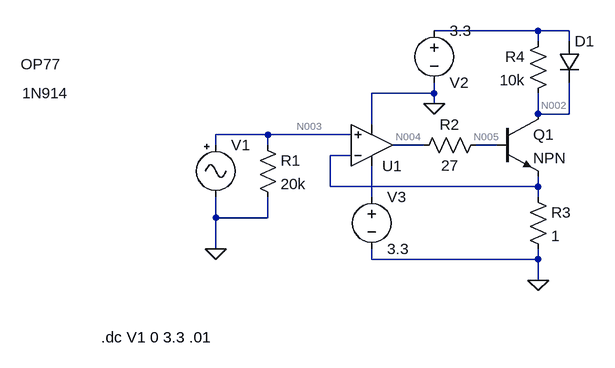
[diagram p0: schematic DiffoP.asc]
DiffoP.asc, the LTspice schematic file:
Version 4
SHEET 1 1828 680
WIRE 448 -32 288 -32
WIRE 496 -32 448 -32
WIRE 448 -16 448 -32
WIRE 496 -16 496 -32
WIRE 288 64 288 48
WIRE 288 64 192 64
WIRE 288 80 288 64
WIRE 448 96 448 64
WIRE 496 96 496 48
WIRE 496 96 448 96
WIRE 192 112 192 64
WIRE 32 128 -48 128
WIRE 160 128 32 128
WIRE -48 144 -48 128
WIRE 32 144 32 128
WIRE 272 144 224 144
WIRE 384 144 352 144
WIRE 160 160 128 160
WIRE 128 208 128 160
WIRE 448 208 448 192
WIRE 448 208 128 208
WIRE 192 224 192 176
WIRE 448 224 448 208
WIRE -48 256 -48 224
WIRE 32 256 32 224
WIRE 32 256 -48 256
WIRE -48 304 -48 256
WIRE 192 320 192 304
WIRE 448 320 448 304
WIRE 448 320 192 320
WIRE 448 352 448 320
FLAG 448 352 0
FLAG -48 304 0
FLAG 288 80 0
SYMBOL Misc\\signal -48 128 R0
WINDOW 3 304 104 Invisible 2
WINDOW 123 0 0 Left 0
WINDOW 39 0 0 Left 0
SYMATTR Value SINE(1.5 1.5 10)
SYMATTR InstName V1
SYMBOL voltage 288 -48 R0
WINDOW 0 24 96 Left 2
WINDOW 3 24 16 Left 2
WINDOW 123 0 0 Left 0
WINDOW 39 0 0 Left 0
SYMATTR InstName V2
SYMATTR Value 3.3
SYMBOL res 16 128 R0
SYMATTR InstName R1
SYMATTR Value 20k
SYMBOL res 368 128 R90
WINDOW 0 0 56 VBottom 2
WINDOW 3 32 56 VTop 2
SYMATTR InstName R2
SYMATTR Value 27
SYMBOL npn 384 96 R0
SYMATTR InstName Q1
SYMBOL res 432 208 R0
SYMATTR InstName R3
SYMATTR Value 1
SYMBOL voltage 192 208 R0
WINDOW 123 0 0 Left 0
WINDOW 39 0 0 Left 0
SYMATTR InstName V3
SYMATTR Value 3.3
SYMBOL res 464 -32 M0
SYMATTR InstName R4
SYMATTR Value 10k
SYMBOL diode 480 -16 R0
WINDOW 3 -826 80 Left 2
SYMATTR Value 1N914
SYMATTR InstName D1
SYMBOL OpAmps\\OP77 192 208 M180
WINDOW 3 -540 189 Left 2
SYMATTR InstName U1
TEXT -224 440 Left 2 !.dc V1 0 3.3 .01

The netlist it stands for:
* DiffoP.asc
V1 N003 0 SINE(1.5 1.5 10)
V2 N001 0 3.3
R1 N003 0 20k
R2 N005 N004 27
Q1 N002 N005 N006 0 NPN
R3 N006 0 1
V3 N007 0 3.3
R4 N001 N002 10k
D1 N001 N002 1N914
XU1 N003 N006 N007 0 N004 OP77  ; pins In+ In- V+ V- OUT
.model D D
.lib standard.dio
.model NPN NPN
.model PNP PNP
.lib standard.bjt
.dc V1 0 3.3 .01
.lib ADI.lib
.backanno
.end

* Results of the author's LTspice run, read from the files saved beside the schematic
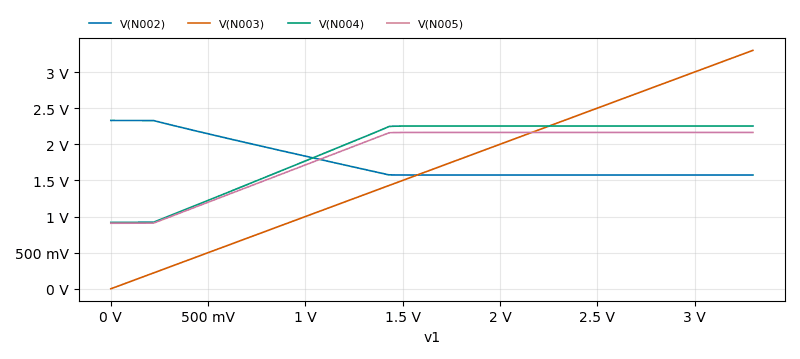
[diagram p1: DC transfer characteristic of DiffoP.asc, plotted from the saved traces]
* DC transfer characteristic, 1 run:
*   V(N002): 2.33 V at v1=0 V, 1.575 V at v1=3.3 V, min 1.575 V, max 2.33 V
*   V(N003): 0 V at v1=0 V, 3.3 V at v1=3.3 V, min 0 V, max 3.3 V
*   V(N004): 919.2 mV at v1=0 V, 2.253 V at v1=3.3 V, min 919.2 mV, max 2.253 V
*   V(N005): 907.1 mV at v1=0 V, 2.164 V at v1=3.3 V, min 907.1 mV, max 2.164 V